# Altium project GUN.PrjPcb (part 2 of 2)

## Sheet 04-HallEffectSensor.SchDoc
size A
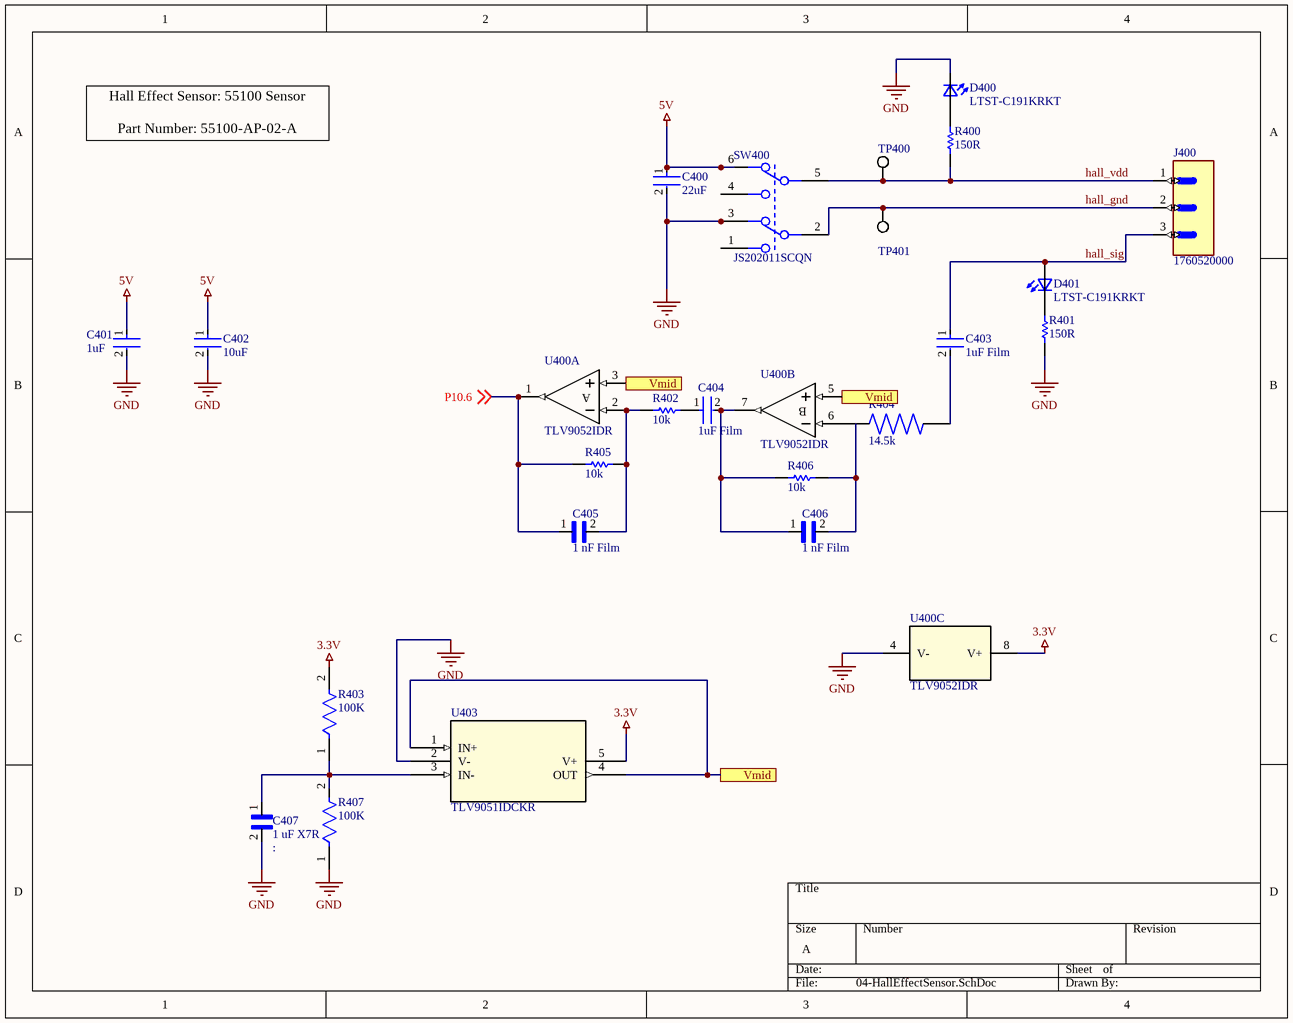
[diagram p3: 04-HallEffectSensor.SchDoc]

### Parts
C400  22uF  [FP-GRM21B-0_15-MFG]
C401  1uF  [FP-CC0805-0_85-MFG]
C402  value 10uF  [FP-C0805C-DG-MFG]  (hidden comment: C0805C106K8PACTU)
C403  1uF Film  [FP-R82DC4100DQ60J-MFG]
C404  1uF Film  [FP-R82DC4100DQ60J-MFG]
C405  1 nF Film  [CAPRR500W50L730T250H650]
C406  1 nF Film  [CAPRR500W50L730T250H650]
C407  1 uF X7R  [CAPC2012X140N]
D400  LTST-C191KRKT  [0603]
D401  LTST-C191KRKT  [0603]
J400  1760520000  [1760520000]
R400  150R  [RESC3216X70X50ML20T25]
R401  150R  [RESC2013X60X40NL20T25]
R402  10k  [RESC2013X60X35ML10T20]
R403  100K  [FP-RC0805-0_6-IPC_C]
R404  14.5k  [RESC2012X60N]
R405  10k  [RESC2013X60X35ML10T20]
R406  10k  [RESC2013X60X35ML10T20]
R407  100K  [FP-RC0805-0_6-IPC_C]
SW400  JS202011SCQN  [FP-JS202011SCQN-MFG]
TP400  5019  [KSTN-5019_V]  (value not drawn)
TP401  5019  [KSTN-5019_V]  (value not drawn)
U400  TLV9052IDR  [D0008A_N]  (parts A,B,C of 3)
U403  TLV9051IDCKR  [SOT_1IDCKR_TEX]

### Ports
Vmid

### Nets
3.3V: R403.2 U400.8(V+) U403.5(V+)
5V: C400.1 C401.1 C402.1 SW400.6
GND: C400.2 C401.2 C402.2 C407.2 D400.1(K2) R401.1 R407.1 SW400.3 U400.4(V-) U403.2(V-)
hall_gnd: J400.2 SW400.2 TP401.1
hall_sig: C403.1 D401.2(A2) J400.3
hall_vdd: J400.1 R400.1 SW400.5 TP400.1
P10.6: C405.1 R405.1 U400.1(OUT) ; off-sheet P10.6
NetC403_2: C403.2 R404.2
NetC404_1: C404.1 R402.2
NetC404_2: C404.2 C406.1 R406.1 U400.7(OUT)
NetC405_2: C405.2 R402.1 R405.2 U400.2(IN-)
NetC406_2: C406.2 R406.2
NetC407_1: C407.1 R403.1 R407.2 U403.3(IN-)
NetD400_2: D400.2(A2) R400.2
NetD401_1: D401.1(K2) R401.2
NetR404_1: R404.1 U400.6(IN-)
NetU400_3: U400.3(IN+) U400.5(IN+) U403.1(IN+) U403.4(OUT) ; port Vmid

Not connected (* = marked no-connect by the designer): SW400 1 4

### Notes on the sheet
- Hall Effect Sensor: 55100 Sensor
  Part Number: 55100-AP-02-A
- (in symbol TLV9052IDR, part A) A
- (in symbol TLV9052IDR, part B) B

### Library data of the parts
C400 = CMP-2007-03385-2: Manufacturer: Murata; Manufacturer Part Number: GRM21BR60J226ME39L; Material: Ceramic; Voltage: 6.3V; Dielectric: X5R; Tolerance: 20%; Max Operating Temperature: 85°C; Min Operating Temperature: -55°C; Case/Package: 0805; Thickness: 0.053inch; Packaging: Tape and Reel; Depth: 1.25mm; Termination: SMD/SMT; Voltage Rating (DC): 6.3V; Radiation Hardening: No; Mount: Surface Mount; Lead Free: Lead Free; Package Quantity: 1; REACH SVHC: No SVHC; Voltage Rating: 6.3V; Capacitance: 22uF; Length: 2mm; Case Code (Imperial): 0805; Case Code (Metric): 2012; Width: 0.049inch; Height: 1.25mm; Supplier 1: Digi-Key; Supplier Part Number 1: 490-1719-1-ND; RoHS: Yes; Category: Ceramic Capacitors; Stock 1: 2705091; Pricing 1: 1=0.37000, 10=0.25600, 50=0.17940, 100=0.15380, 500=0.11532, 1000=0.09739 (USD); Series: GRM; Construction: Flat; RoHS Compliant: Yes; Reach SVHC Compliant: Yes
C401 = CMP-03422-000182-1: CAP CER 1UF 10V X7R 0805; Manufacturer: Yageo; Manufacturer Part Number: CC0805KKX7R6BB105; Material: Ceramic; Tolerance: 0.1; Value: 1 uF; ComponentLink2URL: http://www.yageo.com/documents/recent/UPY-GPHC_Y5V_6.3V-to-50V_8.pdf; Automotive: No; Temperature Range Low: -30°C; Octopart: https://octopart.com/cc0805kkx7r6bb105-yageo-42522859; Temperature Characteristic: X7R; RoHS: TRUE; Voltage Rating: 10 V; Capacitance: 1 uF; Package: CC0805-0.85; Device Class L3: Ceramic Capacitors; Category: Cap; Mouser Description: Multilayer Ceramic Capacitors MLCC - SMD/SMT 1.0uF 10V X7R 10%; Temperature Range High: +85°C; Ipc Land Pattern Name: CAPC200125X85; ComponentLink2Description: Datasheet; Temperature: -30°C to +85°C; Height: 0.95mm; Lead Free: Yes; Device Class L1: Passive Components; Device Class L2: Capacitors; Footprint Url: http://www.yageo.com/exep/pages/download/literatures/UPY-C_GEN_24.pdf; Digikey Description: CAP CER 1UF 10V X7R 0805
C402 = CMP-2007-03243-2: CAP CER 10UF 10V X5R 0805; Manufacturer: Kemet; 3DS Part Number: 220-00001; Tolerance: 10%; Temperature Coefficient: 15%; Material: Ceramic; Device Class L2: Capacitors; Device Class L1: Passive Components; ComponentLink2URL: https://content.kemet.com/datasheets/KEM_C1006_X5R_SMD.pdf; Height: 1.4mm; Lead Free: Yes; Manufacturer Part Number: C0805C106K8PACTU; Digikey Description: CAP CER 10UF 10V X5R 0805; Octopart: https://octopart.com/c0805c106k8pactu-kemet-98697; Capacitance: 10uF; Temperature Range Low: -55°C; Temperature: -55°C to +85°C; Automotive: No; Mouser Description: CAP CER 10UF 10V X5R 0805; Ipc Land Pattern Name: CAPC200125X125; Temperature Range High: +85°C; Voltage: 10V; RoHS: TRUE; Device Class L3: Ceramic Capacitors; ComponentLink2Description: Datasheet; Voltage Rating: 10V; Package: C0805C-DG; Temperature Characteristic: X5R; Category: Cap; Supplier 1: Digi-Key; Supplier Part Number 1: 399-C0805C106K8PAC7800CT-ND; Manufacturer 1: KEMET; Manufacturer Part Number 1: C0805C106K8PACTU; Stock 1: 8631846; Pricing 1: 1=0.14000, 10=0.10300, 50=0.05840, 100=0.04830, 500=0.03388, 1000=0.02805 (USD); Mount: Surface Mount; Case/Package: 0805; Number of Pins: 2; Case Code (Imperial): 0805; Case Code (Metric): 2012; Dielectric Material: Ceramic; Contact Plating: Tin,Matte; Min Operating Temperature: -55°C; Max Operating Temperature: 85°C; Packaging: Tape and Reel; Dielectric: X5R; Package Quantity: 1; Voltage Rating (DC): 10V; Series: C; Termination: SMD/SMT; Construction: Flat; Dissipation Factor: 10%; Length: 2mm; Width: 1.2mm; Depth: 1.25mm; Thickness: 0.055inch; Radiation Hardening: No; REACH SVHC: No SVHC; RoHS Compliant: Yes
C403 C404 = CMP-03022-000017-1: CAP FILM 1UF 5% 63VDC RADIAL; Voltage Rating (DC): 63V; Lead Diameter: 0.5mm; Insulation Resistance: 30R; Dielectric: PET; Voltage Rating (AC): 40V; Dissipation Factor: 80%; Life (Hours): 2000Hour; Type: General Purpose; Mount: Through Hole; Case/Package: Radial; Package Quantity: 1700; Construction: RADIAL; Capacitance: 1uF; Lead Pitch: 5mm; Depth: 5mm; Series: R82; Packaging: Tape and Reel; RoHS Compliant: Yes; Voltage Rating: 63V; Height - Seated (Max): 0.398inch; Voltage: 63V; Radiation Hardening: No; Width: 5mm; REACH SVHC: No SVHC; Min Operating Temperature: -55°C; Tolerance: 5%; Dielectric Material: PET; Contact Plating: Tin; Termination: Radial; Length: 7.2mm; Max Operating Temperature: 105°C
C405 C406 = B32529C0102K289: 1000 pF Film Capacitor 40V 63V Polyester, Polyethylene Terephthalate (PET), Metallized - Stacked Radial; MF: TDK; Check_prices: https://www.snapeda.com/parts/B32529C0102K289/TDK/view-part/?ref=eda; Digi-Key_Part_Number: 495-2456-1-ND; Purchase-URL: https://pricing.snapeda.com/search/part/B32529C0102K289/?ref=eda; Value: *; SnapEDA_Link: https://www.snapeda.com/parts/B32529C0102K289/TDK/view-part/?ref=snap; Package: None; MP: B32529C0102K289; Supplier 1: Digi-Key; Supplier Part Number 1: 495-2456-1-ND
C407 = CL21B105KAFNNNE: 1ÂµF Â±10% 25V Ceramic Capacitor X7R 0805 (2012 Metric); MF: Samsung Electro-Mechanics; SnapEDA_Link: https://www.snapeda.com/parts/CL21B105KAFNNNE/Samsung%20Electro-Mechanics/view-part/544120/?ref=snap; Arrow_Electronics-Purchase-URL: https://snapeda.com/shop?store=Arrow+Electronics&id=544120; Arrow_Europe-Purchase-URL: https://snapeda.com/shop?store=Arrow+Europe&id=544120; MP: CL21B105KAFNNNE; Package: 0805 Samsung; DigiKey-Purchase-URL: https://snapeda.com/shop?store=DigiKey&id=544120; Digi-Key_Part_Number: 1276-1066-1-ND; Value: *; Supplier 1: Digi-Key; Supplier Part Number 1: 1276-1066-1-ND
D400 D401 = LTST-C191KRKT: http://octopart.com/ltst-c190krkt-lite-on-549893; Package: None; MP: LTST-C191KRKT; Value: *; Availability: Unavailable; Price: None; Supplier 1: Digi-Key; Supplier Part Number 1: 160-1447-1-ND
J400 = 1760520000: 3 Position Wire to Board Terminal Block Horizontal with Board 0.200 _5.08mm_ Through Hole; MF: Weidmuller; MP: 1760520000; SnapEDA_Link: https://www.snapeda.com/parts/1760520000/Weidmuller/view-part/423520/?ref=snap; Availability: Unavailable; Package: None; Value: *; Price: None; Supplier 1: Digi-Key; Supplier Part Number 1: 281-1883-ND
R400 = CMP-2003-04422-1: Manufacturer: Panasonic; Part Number: ERA8AEB151V
R401 = CMP-2001-00596-1: Manufacturer: Panasonic; Part Number: ERA6AEB151V
R402 R405 R406 = CMP-2000-05025-1: Chip Resistor, 10 KOhm, +/- 5%, 0.125 W, -55 to 155 degC, 0805 (2012 Metric), RoHS, Tape and Reel; Manufacturer: Yageo; Resistor Element Type: ThickFilm; Voltage Rating: 150V; Product Range: RCSeries; SVHC: ToBeAdvised; Resistor Case Style: 0805[2012Metric]; Temperature Coefficient: ±100ppm/degC; Power Rating: 250mW; Resistance: 10kohm; Automotive Qualification Standard: -; Datasheet Version: REV. 2, 09/2004; Packaging: CutTape; Resistance Tolerance: ±5%; MSL: MSL1-Unlimited; Manufacturer URL: http://www.yageo.com/; Datasheet URL: http://www.yageo.ru/pdf/RC0805.pdf; Package Description: 2-Pin Surface Mounted Device, Body 2 x 1.25 mm; Package Reference: 805
R403 R407 = CMP-2100-03668-5: RES 100K OHM 1% 1/8W 0805; Power Rating: 125mW; Temperature Coefficient: 100ppm/°C; Voltage Rating (DC): 150V; Resistance: 100kR; Package Quantity: 1; Case/Package: 0805; Lead Pitch: 0.4mm; Case Code (Imperial): 0805; Construction: Rectangular; Number of Terminations: 2; RoHS Compliant: Yes; Max Power Dissipation: 125mW; Tolerance: 1%; Max Operating Temperature: 155°C; Resistance Tolerance: 1%; Lead Free: Lead Free; Packaging: Tape and Reel; Resistor Type: Thick Film; Min Operating Temperature: -55°C; Case Code (Metric): 2012; Series: RC; Technology: THICK FILM; Voltage Rating: 150V; Termination: SMD/SMT; Width: 0.049inch; Number of Pins: 2; Features: Moisture Resistant; Military Standard: Not; Length: 0.079inch; Depth: 1.25mm; Size Code: 0805; Height: 0.024inch; Supplier: Digi-Key; Supplier Part Number: 311-100KCRCT-ND
R404 = RT0805DRE0714K5L: Package: None; Price: None; Value: *; MP: RT0805DRE0714K5L; Availability: Unavailable; Supplier 1: Digi-Key; Supplier Part Number 1: 311-2788-1-ND
SW400 = CMP-2000-05087-3: SWITCH SLIDE DPDT 300MA 6V; Switch Function: On-On; Actuator Type: Standard; Switch Travel: 2mm; Actuator Color: Black; Contact Resistance: 70mR; Electrical Life: 5000Cycles; Actuator Material: Nylon; REACH SVHC: No SVHC; Series: JS; Min Operating Temperature: -20°C; Depth: 7.5mm; Housing Material: Nylon; Voltage Rating (DC): 6V; Max Operating Temperature: 85°C; Contact Current Rating: 300mA; Package Quantity: 1; Contact Plating: Silver; Contact Material: Copper Alloy; Throw Configuration: DPDT; Current Rating: 300mA; Orientation: Vertical; Max Current Rating: 300mA; Max Voltage Rating (DC): 6V; Flammability Rating: UL94 V-2; Length: 9mm; Packaging: Tape and Reel; Mount: Surface Mount; Actuator Length: 2mm; Lead Free: Lead Free; Termination: Gull Wing; Radiation Hardening: No
TP400 TP401 = CMP-1672-00008-1: Test Point, 1 Position SMD, RoHS, Tape and Reel; Manufacturer 1: Keystone Electronics; ComponentLink1Description: Manufacturer URL; Package Quantity: 1000; DatasheetVersion: 03/2014; Packaging: Tape and Reel; ComponentLink2URL: http://www.keyelco.com/product-pdf.cfm?p=1357; ComponentLink1URL: http://www.keyelco.com/; Mount: Surface Mount; Contact Plating: Silver; PackageDescription: 1-Pin Surface Mount Device, Body 3.81 x 2.03 mm; Pins: 1; RoHSCompliant: True; Mounting Technology: Surface Mount; ComponentLink2Description: Datasheet; PackageReference: 5019; Supplier 1: Digi-Key; Supplier Part Number 1: 36-5019CT-ND; Manufacturer Part Number 1: 5019; RoHS: Yes; Category: Connectors; Stock 1: 1316816; Pricing 1: 1=0.34000, 25=0.27360, 100=0.22340, 250=0.20064, 500=0.19152 (USD); Number of Pins: 1; Material: Bronze; Contact Material: Bronze; Series: 5019; Termination: SMD/SMT; Height: 0.09inch; RoHS Compliant: Yes; REACH SVHC: No SVHC; Lead Free: Lead Free; ComponentLink3URL: https://datasheet.ciiva.com/16318/m60-2p61-16318395.pdf?src-supplier=Future+Electronics; ComponentLink3Description: https://datasheet.ciiva.com/16318/m60-2p61-16318395.pdf?src-supplier=Future+Electronics; ComponentLink4URL: https://datasheet.ciiva.com/16885/70182998-16885945.pdf?src-supplier=Allied+Electronics; ComponentLink4Description: https://datasheet.ciiva.com/16885/70182998-16885945.pdf?src-supplier=Allied+Electronics; ComponentLink5URL: https://datasheet.ciiva.com/14848/m60-2p61-14848437.pdf?src-supplier=Digi-Key; ComponentLink5Description: https://datasheet.ciiva.com/14848/m60-2p61-14848437.pdf?src-supplier=Digi-Key; ComponentLink6URL: https://datasheet.ciiva.com/14848/m60-2p61-14848438.pdf?src-supplier=Digi-Key; ComponentLink6Description: https://datasheet.ciiva.com/14848/m60-2p61-14848438.pdf?src-supplier=Digi-Key; ComponentLink7URL: https://datasheet.ciiva.com/14848/m60-2p61-14848439.pdf?src-supplier=Digi-Key; ComponentLink7Description: https://datasheet.ciiva.com/14848/m60-2p61-14848439.pdf?src-supplier=Digi-Key
U400 = TLV9052IDR: 5MHz 15V/us High Slew-Rate RRIO Operational Amplifier 8-Pin SOIC T/R; Mfr_Name: Texas Instruments; Type: DEV; RefDes: RefDes; Copyright: Copyright (C) 2023 Ultra Librarian. All rights reserved.; Manufacturer_Part_Number: TLV9052IDR; Supplier: Digi-Key; Supplier Part Number: 296-53049-1-ND; Manufacturer: Texas Instruments; Manufacturer Part Number: TLV9052IDR; RoHS: Yes; Category: Amplifiers - Op Amps, Buffer, Instrumentation; Stock: 44741; Pricing: 1=0.93000, 10=0.82200, 25=0.77240, 100=0.63020, 250=0.58540, 500=0.49820, 1000=0.39856 (USD); RoHS Compliant: Yes; ComponentLink1URL: http://www.ti.com/general/docs/suppproductinfo.tsp?distId=10&amp;gotoUrl=http%3A%2F%2Fwww.ti.com%2Flit%2Fgpn%2Ftlv9052&src-supplier=Digi-Key; ComponentLink1Description: http://www.ti.com/general/docs/suppproductinfo.tsp?distId=10&amp;gotoUrl=http%3A%2F%2Fwww.ti.com%2Flit%2Fgpn%2Ftlv9052&src-supplier=Digi-Key; Supplier 1: Digi-Key; Supplier Part Number 1: 296-53049-1-ND
U403 = TLV9051IDCKR: Single 5-MHz, 15-V/µs high slew-rate, RRIO op amp 5-SC70 -40 to 125; Mfr_Name: Texas Instruments; Copyright: Copyright (C) 2023 Ultra Librarian. All rights reserved.; Manufacturer_Part_Number: TLV9051IDCKR; RefDes: RefDes; Type: DEV; Supplier: Digi-Key; Supplier Part Number: 296-TLV9051IDCKRCT-ND; Manufacturer: Texas Instruments; Manufacturer Part Number: TLV9051IDCKR; RoHS: Yes; Category: Amplifiers - Op Amps, Buffer, Instrumentation; Stock: 2075; Pricing: 1=0.62000, 10=0.54200, 25=0.50920, 100=0.41570, 250=0.38612, 500=0.32860, 1000=0.26288 (USD); Supplier 1: Digi-Key; Supplier Part Number 1: 296-TLV9051IDCKRCT-ND

## Sheet 05-StepperMotor.SchDoc
size A
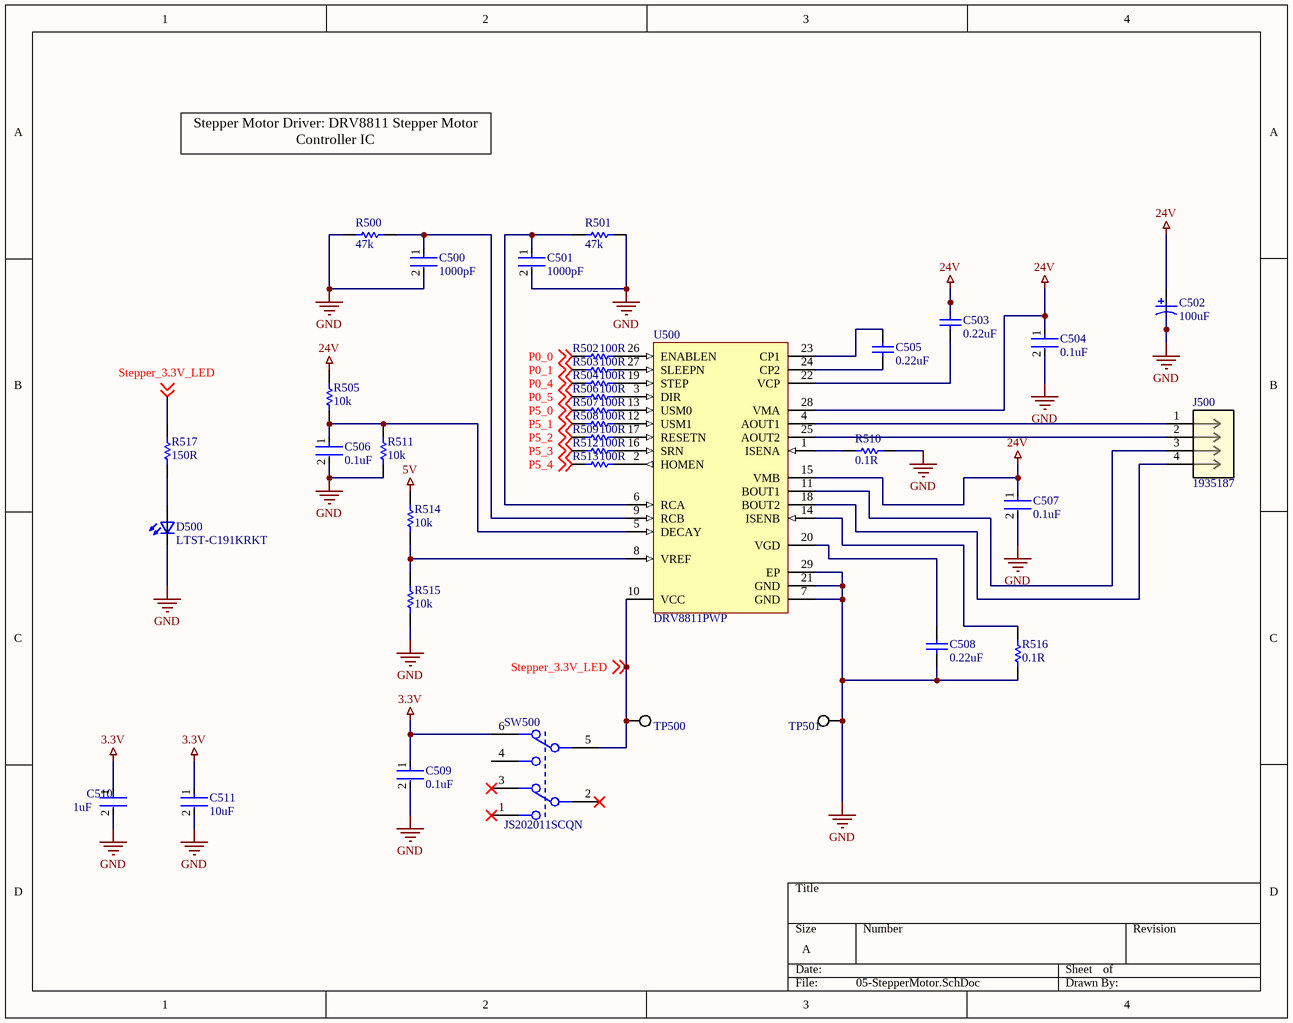
[diagram p4: 05-StepperMotor.SchDoc]

### Parts
C500  1000pF  [FP-0805-L_2_01_0_2-W_1_25-IPC_C]
C501  1000pF  [FP-0805-L_2_01_0_2-W_1_25-IPC_C]
C502  100uF  [PNSC-EEEFK1C101P_L]
C503  0.22uF  [CAPC2013X94X50ML20T25]
C504  0.1uF  [FP-CL21-IPC_C]
C505  0.22uF  [CAPC2013X94X50ML20T25]
C506  0.1uF  [FP-CL21-IPC_C]
C507  0.1uF  [FP-CL21-IPC_C]
C508  0.22uF  [CAPC2013X94X50ML20T25]
C509  0.1uF  [FP-CL21-IPC_C]
C510  1uF  [FP-CC0805-0_85-MFG]
C511  value 10uF  [FP-C0805C-DG-MFG]  (hidden comment: C0805C106K8PACTU)
D500  LTST-C191KRKT  [0603]
J500  1935187  [1935187]
R500  47k  [RESC2013X70X40ML20T20]
R501  47k  [RESC2013X70X40ML20T20]
R502  100R  [RESC2013X60X40ML20T25]
R503  100R  [RESC2013X60X40ML20T25]
R504  100R  [RESC2013X60X40ML20T25]
R505  10k  [RESC2013X60X35ML10T20]
R506  100R  [RESC2013X60X40ML20T25]
R507  100R  [RESC2013X60X40ML20T25]
R508  100R  [RESC2013X60X40ML20T25]
R509  100R  [RESC2013X60X40ML20T25]
R510  0.1R  [RESC2013X50X40ML20T20]
R511  10k  [RESC2013X60X35ML10T20]
R512  100R  [RESC2013X60X40ML20T25]
R513  100R  [RESC2013X60X40ML20T25]
R514  10k  [RESC2013X60X35ML10T20]
R515  10k  [RESC2013X60X35ML10T20]
R516  0.1R  [RESC2013X50X40ML20T20]
R517  150R  [RESC3216X70X50ML20T25]
SW500  JS202011SCQN  [FP-JS202011SCQN-MFG]
TP500  5019  [KSTN-5019_V]  (value not drawn)
TP501  5019  [KSTN-5019_V]  (value not drawn)
U500  DRV8811PWP  [StepperMotor]

### Nets
3.3V: C509.1 C510.1 C511.1 SW500.6
5V: R514.2
24V: C502.1 C503.2 C504.1 C507.1 R505.2 U500.15(VMB) U500.28(VMA)
GND: C500.2 C501.2 C502.2 C504.2 C506.2 C507.2 C508.1 C509.2 C510.2 C511.2 D500.1(K2) R500.1 R501.2 R510.2 R511.1 R515.1 R516.1 TP501.1 U500.7(GND) U500.21(GND) U500.29(EP)
P0_0: R502.1 ; off-sheet P0_0
P0_1: R503.1 ; off-sheet P0_1
P0_4: R504.1 ; off-sheet P0_4
P0_5: R506.1 ; off-sheet P0_5
P5_0: R507.1 ; off-sheet P5_0
P5_1: R508.1 ; off-sheet P5_1
P5_2: R509.1 ; off-sheet P5_2
P5_3: R512.1 ; off-sheet P5_3
P5_4: R513.1 ; off-sheet P5_4
Stepper_3.3V_LED: R517.2 SW500.5 TP500.1 U500.10(VCC) ; off-sheet Stepper_3.3V_LED
NetC500_1: C500.1 R500.2 U500.9(RCB)
NetC501_1: C501.1 R501.1 U500.6(RCA)
NetC503_1: C503.1 U500.22(VCP)
NetC505_1: C505.1 U500.24(CP2)
NetC505_2: C505.2 U500.23(CP1)
NetC506_1: C506.1 R505.1 R511.2 U500.5(DECAY)
NetC508_2: C508.2 U500.20(VGD)
NetD500_2: D500.2(A2) R517.1
NetJ500_1: J500.1 U500.4(AOUT1)
NetJ500_2: J500.2 U500.25(AOUT2)
NetJ500_3: J500.3 U500.11(BOUT1)
NetJ500_4: J500.4 U500.18(BOUT2)
NetR502_2: R502.2 U500.26(ENABLEN)
NetR503_2: R503.2 U500.27(SLEEPN)
NetR504_2: R504.2 U500.19(STEP)
NetR506_2: R506.2 U500.3(DIR)
NetR507_2: R507.2 U500.13(USM0)
NetR508_2: R508.2 U500.12(USM1)
NetR509_2: R509.2 U500.17(RESETN)
NetR510_1: R510.1 U500.1(ISENA)
NetR512_2: R512.2 U500.16(SRN)
NetR513_2: R513.2 U500.2(HOMEN)
NetR514_1: R514.1 R515.2 U500.8(VREF)
NetR516_2: R516.2 U500.14(ISENB)

Not connected (* = marked no-connect by the designer): SW500 1* 2* 3* 4

### Notes on the sheet
- Stepper Motor Driver: DRV8811 Stepper Motor Controller IC

### Library data of the parts
C500 C501 = CMP-2007-04270-2: General Purpose Ceramic Capacitor, 0805, 1nF, 5%, C0G, 30ppm/°C, 50V; Insulation Resistance: 100GR; Capacitance: 1nF; Voltage Rating (DC): 50V; Packaging: Tape and Reel; Min Operating Temperature: -55°C; Series: -; Construction: Flat; Tolerance: 5%; RoHS Compliant: Yes; Package Quantity: 1; Case Code (Metric): 2012; Lead Free: Lead Free; Thickness: 0.037inch; REACH SVHC: No SVHC; Temperature Coefficient: 30ppm/°C; Case/Package: 0805; Case Code: 0805; Radiation Hardening: No; Size: 0.94mm; Height: 0.94mm; Width: 0.049inch; Number of Pins: 2; Depth: 1.25mm; Dielectric: C0G; Contact Plating: Tin; Length: 2.01mm; Voltage: 50V; Voltage Rating: 50V; Max Operating Temperature: 125°C; Mount: Surface Mount; Case Code (Imperial): 0805; Termination: SMD/SMT
C502 = CMP-2000-06203-1: Aluminum Electrolytic Capacitor, 100 uF, 20%, 16 V, -55 to 105 degC, 2-Pin SMD, RoHS, Tape and Reel; Manufacturer: Panasonic; Lifetime@Temperature: 2000Hrs@105°C; Impedance: 0.36O; Ripple Current: 240mA; Rated Voltage: 16V; Type: Can; Capacitance: 100µF; Datasheet URL: http://datasheet.octopart.com/EEEFK1C101P-Panasonic-datasheet-13266987.pdf; Package Description: 2-Pin Surface Mount Device, Body 6.6 x 6.6 mm; Manufacturer URL: http://www.panasonic.com/; Case Size/Dimension: Ø6.3x5.8mm; Series: FK; Datasheet Version: 11/2012; Mounting Technology: SurfaceMount; Package Reference: EEEFK1C101P; Operating Temp-Max: 105°C; Operating Temp Range: -55to+105°C
C503 C505 C508 = CMP-2007-04189-1: Part Number: 08051C224KAT2A; Manufacturer: AVX Interconnect / Elco
C504 C506 C507 C509 = CMP-2000-05017-2: CL21 Series 0805 100nF 50V ±10% Tolerance X7R Multilayer Ceramic Chip Capacitor; Depth: 1.25mm; Height: 0.85mm; Width: 0.049inch; Tolerance: 10%; Case Code (Metric): 2012; Case Code (Imperial): 0805; Material: Ceramic; Thickness: 0.037inch; Min Operating Temperature: -55°C; Contact Plating: Tin; Length: 2mm; Mount: Surface Mount; Voltage Rating (DC): 50V; Lead Free: Lead Free; Dielectric: X7R; Radiation Hardening: No; Capacitance: 100nF; Voltage Rating: 50V; Case/Package: 0805; Packaging: Tape and Reel; Max Operating Temperature: 125°C; Voltage: 50V
C510 = CMP-03422-000182-1: as C401 on sheet 04-HallEffectSensor; Value: 1 uF; ComponentLink2URL: http://www.yageo.com/documents/recent/UPY-GPHC_Y5V_6.3V-to-50V_8.pdf; Automotive: No; Temperature Range Low: -30°C; Octopart: https://octopart.com/cc0805kkx7r6bb105-yageo-42522859; Temperature Characteristic: X7R; RoHS: TRUE; Voltage Rating: 10 V; Capacitance: 1 uF; Package: CC0805-0.85; Device Class L3: Ceramic Capacitors; Category: Cap; Mouser Description: Multilayer Ceramic Capacitors MLCC - SMD/SMT 1.0uF 10V X7R 10%; Temperature Range High: +85°C; Ipc Land Pattern Name: CAPC200125X85; ComponentLink2Description: Datasheet; Temperature: -30°C to +85°C; Height: 0.95mm; Lead Free: Yes; Device Class L1: Passive Components; Device Class L2: Capacitors; Footprint Url: http://www.yageo.com/exep/pages/download/literatures/UPY-C_GEN_24.pdf; Digikey Description: CAP CER 1UF 10V X7R 0805
C511 = CMP-2007-03243-2: as C402 on sheet 04-HallEffectSensor; Device Class L2: Capacitors; Device Class L1: Passive Components; ComponentLink2URL: https://content.kemet.com/datasheets/KEM_C1006_X5R_SMD.pdf; Height: 1.4mm; Lead Free: Yes; Manufacturer Part Number: C0805C106K8PACTU; Digikey Description: CAP CER 10UF 10V X5R 0805; Octopart: https://octopart.com/c0805c106k8pactu-kemet-98697; Capacitance: 10uF; Temperature Range Low: -55°C; Temperature: -55°C to +85°C; Automotive: No; Mouser Description: CAP CER 10UF 10V X5R 0805; Ipc Land Pattern Name: CAPC200125X125; Temperature Range High: +85°C; Voltage: 10V; RoHS: TRUE; Device Class L3: Ceramic Capacitors; ComponentLink2Description: Datasheet; Voltage Rating: 10V; Package: C0805C-DG; Temperature Characteristic: X5R; Category: Cap; Supplier 1: Digi-Key; Supplier Part Number 1: 399-C0805C106K8PAC7800CT-ND; Manufacturer 1: KEMET; Manufacturer Part Number 1: C0805C106K8PACTU; Stock 1: 8631846; Pricing 1: 1=0.14000, 10=0.10300, 50=0.05840, 100=0.04830, 500=0.03388, 1000=0.02805 (USD); Mount: Surface Mount; Case/Package: 0805; Number of Pins: 2; Case Code (Imperial): 0805; Case Code (Metric): 2012; Dielectric Material: Ceramic; Contact Plating: Tin,Matte; Min Operating Temperature: -55°C; Max Operating Temperature: 85°C; Packaging: Tape and Reel; Dielectric: X5R; Package Quantity: 1; Voltage Rating (DC): 10V; Series: C; Termination: SMD/SMT; Construction: Flat; Dissipation Factor: 10%; Length: 2mm; Width: 1.2mm; Depth: 1.25mm; Thickness: 0.055inch; Radiation Hardening: No; REACH SVHC: No SVHC; RoHS Compliant: Yes
D500 = LTST-C191KRKT: as D400 on sheet 04-HallEffectSensor; Package: None; MP: LTST-C191KRKT; Value: *; Availability: Unavailable; Price: None; Supplier 1: Digi-Key; Supplier Part Number 1: 160-1447-1-ND
J500 = 1935187: No Description Available; Mfr_Name: Phoenix Contact; RefDes: RefDes; Type: Type; Supplier 1: Digi-Key; Supplier Part Number 1: 277-1579-ND
R500 R501 = CMP-2001-00421-1: Manufacturer: Panasonic; Part Number: ERJ-6GEYJ473V
R502-R504 R506-R509 R512 R513 = CMP-2001-00580-1: Manufacturer: Panasonic; Part Number: ERA6AEB101V
R505 R511 R514 R515 = CMP-2000-05025-1: as R402 on sheet 04-HallEffectSensor; Automotive Qualification Standard: -; Datasheet Version: REV. 2, 09/2004; Packaging: CutTape; Resistance Tolerance: ±5%; MSL: MSL1-Unlimited; Manufacturer URL: http://www.yageo.com/; Datasheet URL: http://www.yageo.ru/pdf/RC0805.pdf; Package Description: 2-Pin Surface Mounted Device, Body 2 x 1.25 mm; Package Reference: 805
R510 R516 = CMP-2001-03150-1: Manufacturer: Susumu; Part Number: RL1220S-R10-F
R517 = CMP-2003-04422-1: as R400 on sheet 04-HallEffectSensor
SW500 = CMP-2000-05087-3: as SW400 on sheet 04-HallEffectSensor; REACH SVHC: No SVHC; Series: JS; Min Operating Temperature: -20°C; Depth: 7.5mm; Housing Material: Nylon; Voltage Rating (DC): 6V; Max Operating Temperature: 85°C; Contact Current Rating: 300mA; Package Quantity: 1; Contact Plating: Silver; Contact Material: Copper Alloy; Throw Configuration: DPDT; Current Rating: 300mA; Orientation: Vertical; Max Current Rating: 300mA; Max Voltage Rating (DC): 6V; Flammability Rating: UL94 V-2; Length: 9mm; Packaging: Tape and Reel; Mount: Surface Mount; Actuator Length: 2mm; Lead Free: Lead Free; Termination: Gull Wing; Radiation Hardening: No
TP500 TP501 = CMP-1672-00008-1: as TP400 on sheet 04-HallEffectSensor; ComponentLink1Description: Manufacturer URL; Package Quantity: 1000; DatasheetVersion: 03/2014; Packaging: Tape and Reel; ComponentLink2URL: http://www.keyelco.com/product-pdf.cfm?p=1357; ComponentLink1URL: http://www.keyelco.com/; Mount: Surface Mount; Contact Plating: Silver; PackageDescription: 1-Pin Surface Mount Device, Body 3.81 x 2.03 mm; Pins: 1; RoHSCompliant: True; Mounting Technology: Surface Mount; ComponentLink2Description: Datasheet; PackageReference: 5019; Supplier 1: Digi-Key; Supplier Part Number 1: 36-5019CT-ND; Manufacturer Part Number 1: 5019; RoHS: Yes; Category: Connectors; Stock 1: 1316816; Pricing 1: 1=0.34000, 25=0.27360, 100=0.22340, 250=0.20064, 500=0.19152 (USD); Number of Pins: 1; Material: Bronze; Contact Material: Bronze; Series: 5019; Termination: SMD/SMT; Height: 0.09inch; RoHS Compliant: Yes; REACH SVHC: No SVHC; Lead Free: Lead Free; ComponentLink3URL: https://datasheet.ciiva.com/16318/m60-2p61-16318395.pdf?src-supplier=Future+Electronics; ComponentLink3Description: https://datasheet.ciiva.com/16318/m60-2p61-16318395.pdf?src-supplier=Future+Electronics; ComponentLink4URL: https://datasheet.ciiva.com/16885/70182998-16885945.pdf?src-supplier=Allied+Electronics; ComponentLink4Description: https://datasheet.ciiva.com/16885/70182998-16885945.pdf?src-supplier=Allied+Electronics; ComponentLink5URL: https://datasheet.ciiva.com/14848/m60-2p61-14848437.pdf?src-supplier=Digi-Key; ComponentLink5Description: https://datasheet.ciiva.com/14848/m60-2p61-14848437.pdf?src-supplier=Digi-Key; ComponentLink6URL: https://datasheet.ciiva.com/14848/m60-2p61-14848438.pdf?src-supplier=Digi-Key; ComponentLink6Description: https://datasheet.ciiva.com/14848/m60-2p61-14848438.pdf?src-supplier=Digi-Key; ComponentLink7URL: https://datasheet.ciiva.com/14848/m60-2p61-14848439.pdf?src-supplier=Digi-Key; ComponentLink7Description: https://datasheet.ciiva.com/14848/m60-2p61-14848439.pdf?src-supplier=Digi-Key
U500 = StepperMotor: 1.9 A Bipolar Stepper Motor Driver with On-Chip 1 / 8 Microstepping Indexer (Step / Dir Ctrl), -40 to 85 degC, 28-pin HTSSOP (PWP), Green (RoHS & no Sb/Br); Thermal Shutdown: TRUE; Peak Output Current(A): 1.9; PackageVersion: 4073225-6/I, 05/2011; ComponentLink2URL: http://www.ti.com/general/docs/lit/getliterature.tsp?genericPartNumber=DRV8811&fileType=pdf; Eco-Plan: Green (RoHS & no Sb/Br); ComponentLink3URL: http://www.ti.com/litv/pdf/mpds373; PackageDescription: 28-Pin Plastic Small Outline, Body 9.70 x 4.40 mm, Pitch 0.65 mm; DatasheetVersion: SLVS865G; Code_JEDEC: MO-153; ComponentLink1URL: http://www.ti.com/; ComponentLink1Description: Manufacturer URL; ComponentLink2Description: Datasheet; Package Reference: PWP0028C; PartNumber: DRV8811PWP; Mounting Technology: Surface Mount; ComponentLink3Description: Package Specification

## Sheet 06-ServoMotor.SchDoc
size A
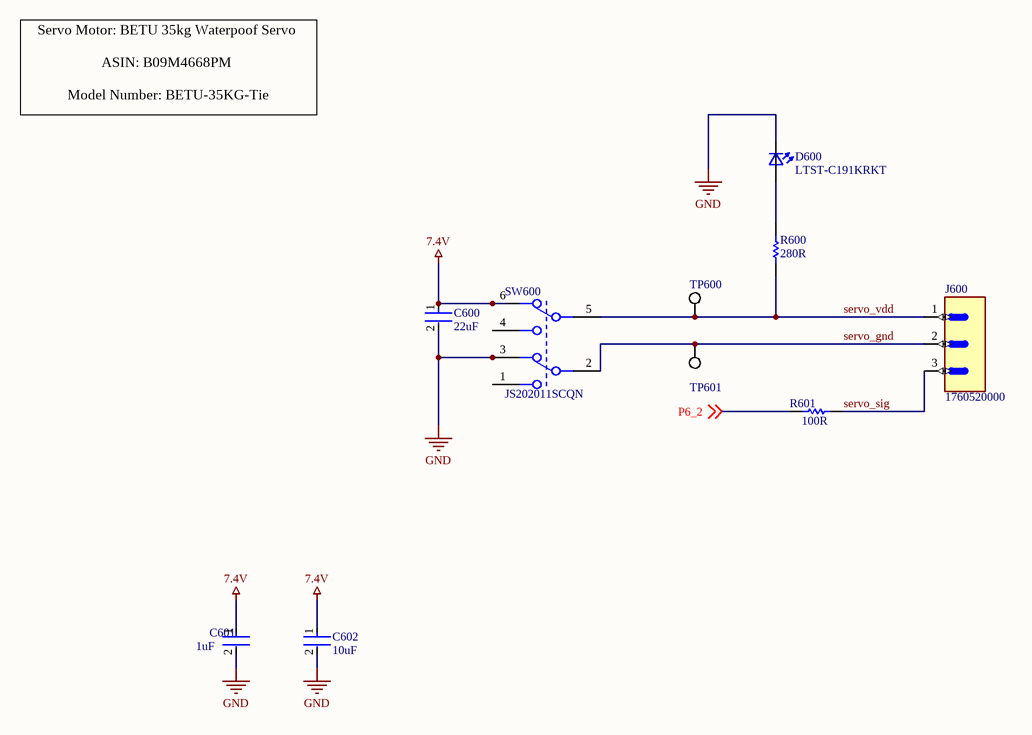
[diagram p5: 06-ServoMotor.SchDoc]

### Parts
C600  22uF  [FP-GRM21B-0_15-MFG]
C601  1uF  [FP-CC0805-0_85-MFG]
C602  value 10uF  [FP-C0805C-DG-MFG]  (hidden comment: C0805C106K8PACTU)
D600  LTST-C191KRKT  [0603]
J600  1760520000  [1760520000]
R600  280R  [RESC3225X70X50LL20T20]
R601  100R  [RESC2013X60X40ML20T25]
SW600  JS202011SCQN  [FP-JS202011SCQN-MFG]
TP600  5019  [KSTN-5019_V]  (value not drawn)
TP601  5019  [KSTN-5019_V]  (value not drawn)

### Nets
7.4V: C600.1 C601.1 C602.1 SW600.6
GND: C600.2 C601.2 C602.2 D600.1(K2) SW600.3
P6_2: R601.1 ; off-sheet P6_2
servo_gnd: J600.2 SW600.2 TP601.1
servo_sig: J600.3 R601.2
servo_vdd: J600.1 R600.1 SW600.5 TP600.1
NetD600_2: D600.2(A2) R600.2

Not connected (* = marked no-connect by the designer): SW600 1 4

### Notes on the sheet
- Servo Motor: BETU 35kg Waterpoof Servo
  ASIN: B09M4668PM
  Model Number: BETU-35KG-Tie

### Library data of the parts
C600 = CMP-2007-03385-2: as C400 on sheet 04-HallEffectSensor; Max Operating Temperature: 85°C; Min Operating Temperature: -55°C; Case/Package: 0805; Thickness: 0.053inch; Packaging: Tape and Reel; Depth: 1.25mm; Termination: SMD/SMT; Voltage Rating (DC): 6.3V; Radiation Hardening: No; Mount: Surface Mount; Lead Free: Lead Free; Package Quantity: 1; REACH SVHC: No SVHC; Voltage Rating: 6.3V; Capacitance: 22uF; Length: 2mm; Case Code (Imperial): 0805; Case Code (Metric): 2012; Width: 0.049inch; Height: 1.25mm; Supplier 1: Digi-Key; Supplier Part Number 1: 490-1719-1-ND; RoHS: Yes; Category: Ceramic Capacitors; Stock 1: 2705091; Pricing 1: 1=0.37000, 10=0.25600, 50=0.17940, 100=0.15380, 500=0.11532, 1000=0.09739 (USD); Series: GRM; Construction: Flat; RoHS Compliant: Yes; Reach SVHC Compliant: Yes
C601 = CMP-03422-000182-1: as C401 on sheet 04-HallEffectSensor; Value: 1 uF; ComponentLink2URL: http://www.yageo.com/documents/recent/UPY-GPHC_Y5V_6.3V-to-50V_8.pdf; Automotive: No; Temperature Range Low: -30°C; Octopart: https://octopart.com/cc0805kkx7r6bb105-yageo-42522859; Temperature Characteristic: X7R; RoHS: TRUE; Voltage Rating: 10 V; Capacitance: 1 uF; Package: CC0805-0.85; Device Class L3: Ceramic Capacitors; Category: Cap; Mouser Description: Multilayer Ceramic Capacitors MLCC - SMD/SMT 1.0uF 10V X7R 10%; Temperature Range High: +85°C; Ipc Land Pattern Name: CAPC200125X85; ComponentLink2Description: Datasheet; Temperature: -30°C to +85°C; Height: 0.95mm; Lead Free: Yes; Device Class L1: Passive Components; Device Class L2: Capacitors; Footprint Url: http://www.yageo.com/exep/pages/download/literatures/UPY-C_GEN_24.pdf; Digikey Description: CAP CER 1UF 10V X7R 0805
C602 = CMP-2007-03243-2: as C402 on sheet 04-HallEffectSensor; Device Class L2: Capacitors; Device Class L1: Passive Components; ComponentLink2URL: https://content.kemet.com/datasheets/KEM_C1006_X5R_SMD.pdf; Height: 1.4mm; Lead Free: Yes; Manufacturer Part Number: C0805C106K8PACTU; Digikey Description: CAP CER 10UF 10V X5R 0805; Octopart: https://octopart.com/c0805c106k8pactu-kemet-98697; Capacitance: 10uF; Temperature Range Low: -55°C; Temperature: -55°C to +85°C; Automotive: No; Mouser Description: CAP CER 10UF 10V X5R 0805; Ipc Land Pattern Name: CAPC200125X125; Temperature Range High: +85°C; Voltage: 10V; RoHS: TRUE; Device Class L3: Ceramic Capacitors; ComponentLink2Description: Datasheet; Voltage Rating: 10V; Package: C0805C-DG; Temperature Characteristic: X5R; Category: Cap; Supplier 1: Digi-Key; Supplier Part Number 1: 399-C0805C106K8PAC7800CT-ND; Manufacturer 1: KEMET; Manufacturer Part Number 1: C0805C106K8PACTU; Stock 1: 8631846; Pricing 1: 1=0.14000, 10=0.10300, 50=0.05840, 100=0.04830, 500=0.03388, 1000=0.02805 (USD); Mount: Surface Mount; Case/Package: 0805; Number of Pins: 2; Case Code (Imperial): 0805; Case Code (Metric): 2012; Dielectric Material: Ceramic; Contact Plating: Tin,Matte; Min Operating Temperature: -55°C; Max Operating Temperature: 85°C; Packaging: Tape and Reel; Dielectric: X5R; Package Quantity: 1; Voltage Rating (DC): 10V; Series: C; Termination: SMD/SMT; Construction: Flat; Dissipation Factor: 10%; Length: 2mm; Width: 1.2mm; Depth: 1.25mm; Thickness: 0.055inch; Radiation Hardening: No; REACH SVHC: No SVHC; RoHS Compliant: Yes
D600 = LTST-C191KRKT: as D400 on sheet 04-HallEffectSensor; Package: None; MP: LTST-C191KRKT; Value: *; Availability: Unavailable; Price: None; Supplier 1: Digi-Key; Supplier Part Number 1: 160-1447-1-ND
J600 = 1760520000: as J400 on sheet 04-HallEffectSensor; MP: 1760520000; SnapEDA_Link: https://www.snapeda.com/parts/1760520000/Weidmuller/view-part/423520/?ref=snap; Availability: Unavailable; Package: None; Value: *; Price: None; Supplier 1: Digi-Key; Supplier Part Number 1: 281-1883-ND
R600 = CMP-2005-03252-1: Part Number: ERJ-14NF2800U; Manufacturer: Panasonic
R601 = CMP-2001-00580-1: as R502 on sheet 05-StepperMotor
SW600 = CMP-2000-05087-3: as SW400 on sheet 04-HallEffectSensor; REACH SVHC: No SVHC; Series: JS; Min Operating Temperature: -20°C; Depth: 7.5mm; Housing Material: Nylon; Voltage Rating (DC): 6V; Max Operating Temperature: 85°C; Contact Current Rating: 300mA; Package Quantity: 1; Contact Plating: Silver; Contact Material: Copper Alloy; Throw Configuration: DPDT; Current Rating: 300mA; Orientation: Vertical; Max Current Rating: 300mA; Max Voltage Rating (DC): 6V; Flammability Rating: UL94 V-2; Length: 9mm; Packaging: Tape and Reel; Mount: Surface Mount; Actuator Length: 2mm; Lead Free: Lead Free; Termination: Gull Wing; Radiation Hardening: No
TP600 TP601 = CMP-1672-00008-1: as TP400 on sheet 04-HallEffectSensor; ComponentLink1Description: Manufacturer URL; Package Quantity: 1000; DatasheetVersion: 03/2014; Packaging: Tape and Reel; ComponentLink2URL: http://www.keyelco.com/product-pdf.cfm?p=1357; ComponentLink1URL: http://www.keyelco.com/; Mount: Surface Mount; Contact Plating: Silver; PackageDescription: 1-Pin Surface Mount Device, Body 3.81 x 2.03 mm; Pins: 1; RoHSCompliant: True; Mounting Technology: Surface Mount; ComponentLink2Description: Datasheet; PackageReference: 5019; Supplier 1: Digi-Key; Supplier Part Number 1: 36-5019CT-ND; Manufacturer Part Number 1: 5019; RoHS: Yes; Category: Connectors; Stock 1: 1316816; Pricing 1: 1=0.34000, 25=0.27360, 100=0.22340, 250=0.20064, 500=0.19152 (USD); Number of Pins: 1; Material: Bronze; Contact Material: Bronze; Series: 5019; Termination: SMD/SMT; Height: 0.09inch; RoHS Compliant: Yes; REACH SVHC: No SVHC; Lead Free: Lead Free; ComponentLink3URL: https://datasheet.ciiva.com/16318/m60-2p61-16318395.pdf?src-supplier=Future+Electronics; ComponentLink3Description: https://datasheet.ciiva.com/16318/m60-2p61-16318395.pdf?src-supplier=Future+Electronics; ComponentLink4URL: https://datasheet.ciiva.com/16885/70182998-16885945.pdf?src-supplier=Allied+Electronics; ComponentLink4Description: https://datasheet.ciiva.com/16885/70182998-16885945.pdf?src-supplier=Allied+Electronics; ComponentLink5URL: https://datasheet.ciiva.com/14848/m60-2p61-14848437.pdf?src-supplier=Digi-Key; ComponentLink5Description: https://datasheet.ciiva.com/14848/m60-2p61-14848437.pdf?src-supplier=Digi-Key; ComponentLink6URL: https://datasheet.ciiva.com/14848/m60-2p61-14848438.pdf?src-supplier=Digi-Key; ComponentLink6Description: https://datasheet.ciiva.com/14848/m60-2p61-14848438.pdf?src-supplier=Digi-Key; ComponentLink7URL: https://datasheet.ciiva.com/14848/m60-2p61-14848439.pdf?src-supplier=Digi-Key; ComponentLink7Description: https://datasheet.ciiva.com/14848/m60-2p61-14848439.pdf?src-supplier=Digi-Key

## Sheet 07-UARTBridge.SchDoc
size A
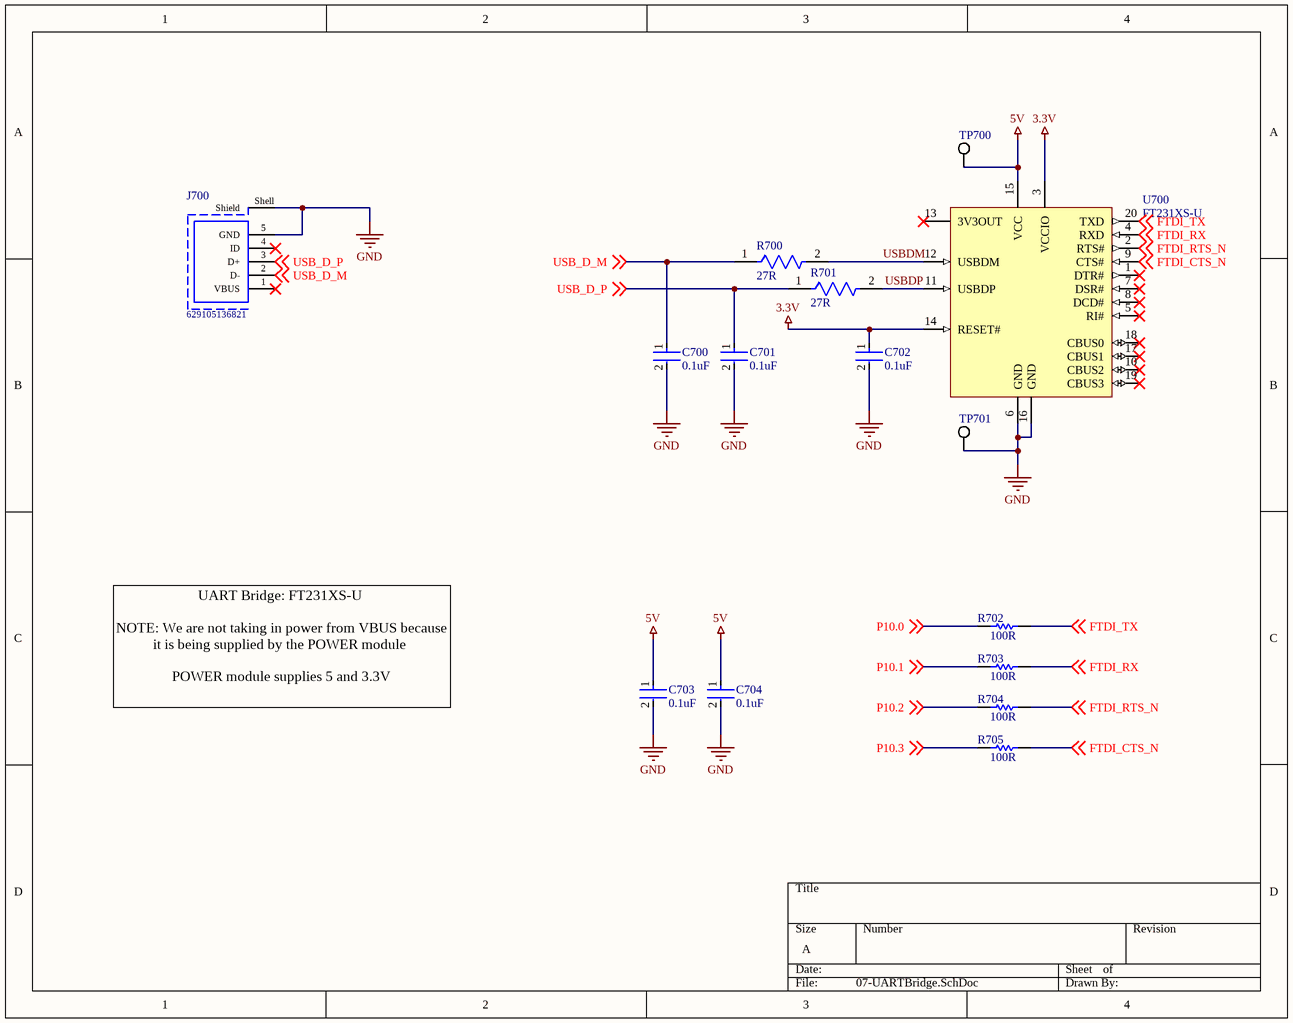
[diagram p6: 07-UARTBridge.SchDoc]

### Parts
C700  0.1uF  [FP-CL21-IPC_C]
C701  0.1uF  [FP-CL21-IPC_C]
C702  0.1uF  [FP-CL21-IPC_C]
C703  0.1uF  [FP-CL21-IPC_C]
C704  0.1uF  [FP-CL21-IPC_C]
J700  629105136821  [629105136821]
R700  27R  [FP-CRGCQ0805-IPC_C]
R701  27R  [FP-CRGCQ0805-IPC_C]
R702  100R  [RESC2013X60X40ML20T25]
R703  100R  [RESC2013X60X40ML20T25]
R704  100R  [RESC2013X60X40ML20T25]
R705  100R  [RESC2013X60X40ML20T25]
TP700  5019  [KSTN-5019_V]  (value not drawn)
TP701  5019  [KSTN-5019_V]  (value not drawn)
U700  FT231XS-U  [SSOP-20_L]

### Nets
3.3V: C702.1 U700.3(VCCIO) U700.14(RESET#)
5V: C703.1 C704.1 TP700.1 U700.15(VCC)
GND: C700.2 C701.2 C702.2 C703.2 C704.2 J700.5(GND) J700.Shell(Shield) TP701.1 U700.6(GND) U700.16(GND)
FTDI_CTS_N: R705.2 U700.9(CTS#) ; off-sheet FTDI_CTS_N
FTDI_RTS_N: R704.2 U700.2(RTS#) ; off-sheet FTDI_RTS_N
FTDI_RX: R703.2 U700.4(RXD) ; off-sheet FTDI_RX
FTDI_TX: R702.2 U700.20(TXD) ; off-sheet FTDI_TX
P10.0: R702.1 ; off-sheet P10.0
P10.1: R703.1 ; off-sheet P10.1
P10.2: R704.1 ; off-sheet P10.2
P10.3: R705.1 ; off-sheet P10.3
USB_D_M: C700.1 J700.2(D-) R700.1 ; off-sheet USB_D_M
USB_D_P: C701.1 J700.3(D+) R701.1 ; off-sheet USB_D_P
USBDM: R700.2 U700.12(USBDM)
USBDP: R701.2 U700.11(USBDP)

Not connected (* = marked no-connect by the designer): J700 1(VBUS)* 4(ID)*; U700 1(DTR#)* 5(RI#)* 7(DSR#)* 8(DCD#)* 10(CBUS2)* 13(3V3OUT)* 17(CBUS1)* 18(CBUS0)* 19(CBUS3)*

### Notes on the sheet
- UART Bridge: FT231XS-U
  NOTE: We are not taking in power from VBUS because it is being supplied by the POWER module
  POWER module supplies 5 and 3.3V

### Library data of the parts
C700-C704 = CMP-2000-05017-2: as C504 on sheet 05-StepperMotor; Depth: 1.25mm; Height: 0.85mm; Width: 0.049inch; Tolerance: 10%; Case Code (Metric): 2012; Case Code (Imperial): 0805; Material: Ceramic; Thickness: 0.037inch; Min Operating Temperature: -55°C; Contact Plating: Tin; Length: 2mm; Mount: Surface Mount; Voltage Rating (DC): 50V; Lead Free: Lead Free; Dielectric: X7R; Radiation Hardening: No; Capacitance: 100nF; Voltage Rating: 50V; Case/Package: 0805; Packaging: Tape and Reel; Max Operating Temperature: 125°C; Voltage: 50V
J700 = CMP-1502-03253-1: Micro USB 2.0 Type B Receptacle WR-COM, Horizontal, SMT, with Pads and Pegs; Manufacturer: Wurth Elektronik; Contact Resistance: 30mOhm; Rated Current: 1A; Working Voltage: 30VAC; Datasheet URL: https://katalog.we-online.de/em/datasheet/629105136821.pdf; Mounting Technology: SMT; Publisher: WurthElektronik; Package Reference: 629105136821; Orientation: Horizontal; Packaging: TapeandReel; Part Number: 629105136821; Manufacturer URL: http://www.we-online.de; Connector Type: MicroUSB2.0TypeB; Gender: Receptacle; Operating Temperature: -40to105degC
R700 R701 = CMP-03211-007904-1: CRGCQ0805 27Ω 0.125W ±200ppm/°C 1% 150V; Manufacturer: TE Connectivity; Manufacturer Part Number: CRGCQ0805F27R; Automotive Grade: Grade 323; Tolerance: 0.01; Series: CRGCQ; Automotive: Yes; Temperature Range Low: -55°C; Voltage Rating: 150V; Height: 0.65mm; Power Rating: 0.125W; Temperature Coefficient: ±200ppm/°C; RoHS: TRUE; ComponentLink2Description: Datasheet; Package: CRGCQ0805; Temperature Range High: +155°C; Temperature: -55°C to +155°C; Ipc Land Pattern Name: RESC200125X55; Device Class L2: Resistors; Device Class L3: Chip SMD Resistors; ComponentLink2URL: https://www.te.com/commerce/DocumentDelivery/DDEController?Action=showdoc&DocId=Data+Sheet%7F1773204-3%7F1%7Fpdf%7FEnglish%7FENG_DS_1773204-3_1.pdf%7F4-2176341-332; Value: 27Ω; Mouser Description: Res General Purpose Thick Film 0805 27 Ohm 1% 1/8W ±200ppm/°C Molded Paper T/R; Octopart: https://octopart.com/crgcq0805f27r-te+connectivity-91018166; Lead Free: Yes; Composition: Thick Film; Ambient Temperature Range High: +70°C; Category: Res; Resistance: 27Ω; Device Class L1: Passive Components
R702-R705 = CMP-2001-00580-1: as R502 on sheet 05-StepperMotor
TP700 TP701 = CMP-1672-00008-1: as TP400 on sheet 04-HallEffectSensor; ComponentLink1Description: Manufacturer URL; Package Quantity: 1000; DatasheetVersion: 03/2014; Packaging: Tape and Reel; ComponentLink2URL: http://www.keyelco.com/product-pdf.cfm?p=1357; ComponentLink1URL: http://www.keyelco.com/; Mount: Surface Mount; Contact Plating: Silver; PackageDescription: 1-Pin Surface Mount Device, Body 3.81 x 2.03 mm; Pins: 1; RoHSCompliant: True; Mounting Technology: Surface Mount; ComponentLink2Description: Datasheet; PackageReference: 5019; Supplier 1: Digi-Key; Supplier Part Number 1: 36-5019CT-ND; Manufacturer Part Number 1: 5019; RoHS: Yes; Category: Connectors; Stock 1: 1316816; Pricing 1: 1=0.34000, 25=0.27360, 100=0.22340, 250=0.20064, 500=0.19152 (USD); Number of Pins: 1; Material: Bronze; Contact Material: Bronze; Series: 5019; Termination: SMD/SMT; Height: 0.09inch; RoHS Compliant: Yes; REACH SVHC: No SVHC; Lead Free: Lead Free; ComponentLink3URL: https://datasheet.ciiva.com/16318/m60-2p61-16318395.pdf?src-supplier=Future+Electronics; ComponentLink3Description: https://datasheet.ciiva.com/16318/m60-2p61-16318395.pdf?src-supplier=Future+Electronics; ComponentLink4URL: https://datasheet.ciiva.com/16885/70182998-16885945.pdf?src-supplier=Allied+Electronics; ComponentLink4Description: https://datasheet.ciiva.com/16885/70182998-16885945.pdf?src-supplier=Allied+Electronics; ComponentLink5URL: https://datasheet.ciiva.com/14848/m60-2p61-14848437.pdf?src-supplier=Digi-Key; ComponentLink5Description: https://datasheet.ciiva.com/14848/m60-2p61-14848437.pdf?src-supplier=Digi-Key; ComponentLink6URL: https://datasheet.ciiva.com/14848/m60-2p61-14848438.pdf?src-supplier=Digi-Key; ComponentLink6Description: https://datasheet.ciiva.com/14848/m60-2p61-14848438.pdf?src-supplier=Digi-Key; ComponentLink7URL: https://datasheet.ciiva.com/14848/m60-2p61-14848439.pdf?src-supplier=Digi-Key; ComponentLink7Description: https://datasheet.ciiva.com/14848/m60-2p61-14848439.pdf?src-supplier=Digi-Key
U700 = CMP-0248-00015-2: USB to Full-Handshake UART Interface Chip, UHCI/OHCI/EHCI Compatible, USB 2.0 Compatible, -40 to +85 degC, 20-Pin SSOP, Pb-Free, Tube; Manufacturer: FTDI; PackageDescription: 20-Pin Small Outline Package, 8.6 x 3.9 mm Body, 0.635 mm Pitch; ComponentLink2Description: Datasheet; DatasheetVersion: ver 1.2, Feb-2013; PackageReference: SSOP-20; ComponentLink3URL: www.ftdichip.com/Products/ICs/FT231X.html; ComponentLink2URL: http://www.ftdichip.com/Support/Documents/DataSheets/ICs/DS_FT231X.pdf; PartNumber: FT231XS-U; ComponentLink3Description: FT231X Product Page; ComponentLink1URL: http://www.ftdichip.com/; Code_JEDEC: MO-137-AD; ComponentLink1Description: Manufacturer URL; RevisionNote: DatasheetVersion updated to 1.2 Feb-2013; PackageVersion: Feb-13

## Sheet 08-SwitchingRegulator.SchDoc
size A
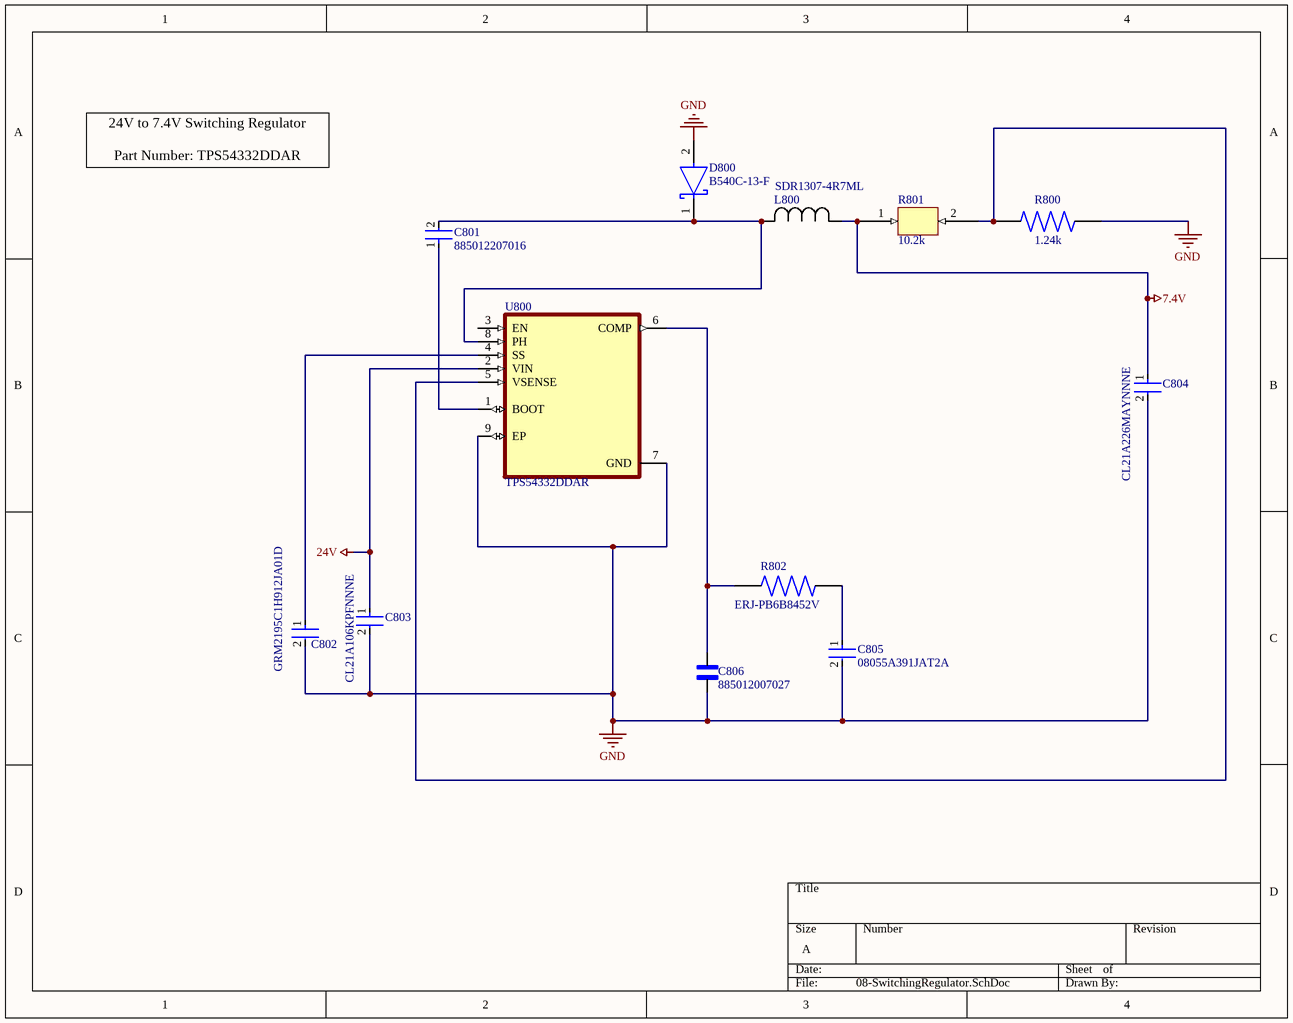
[diagram p7: 08-SwitchingRegulator.SchDoc]

### Parts
C801  885012207016  [FP-885012207016-MFG]
C802  GRM2195C1H912JA01D  [FP-GRM219-0_1-MFG]
C803  CL21A106KPFNNNE  [FP-CL21-IPC_B]
C804  CL21A226MAYNNNE  [FP-CL21-IPC_C]
C805  08055A391JAT2A  [FP-0805-L_2_01_0_2-W_1_25-IPC_C]
C806  885012007027  [WCAP-CSGP_885012007027]
D800  B540C-13-F  [FP-SMC-MFG]
L800  SDR1307-4R7ML  [IND_BOURNS_SDR1307]
R800  value 1.24k  [RES_ERJ1TNF1241U]  (hidden comment: ERJ-1TNF1241U)
R801  10.2k  [PCBComponent_1]
R802  ERJ-PB6B8452V  [RES_ERJ-PB6B1004V]
U800  TPS54332DDAR  [VREG_LM5017MR/NOPB]

### Nets
7.4V: C804.1 L800.1 R801.1
24V: C803.1 U800.2(VIN)
GND: C802.2 C803.2 C804.2 C805.2 C806.1 D800.2(A) R800.1 U800.7(GND) U800.9(EP)
NetC801_1: C801.1 U800.1(BOOT)
NetC801_2: C801.2 D800.1(C) L800.2 U800.8(PH)
NetC802_1: C802.1 U800.4(SS)
NetC805_1: C805.1 R802.1
NetC806_2: C806.2 R802.2 U800.6(COMP)
NetR800_2: R800.2 R801.2 U800.5(VSENSE)

Not connected (* = marked no-connect by the designer): U800 3(EN)

### Notes on the sheet
- 24V to 7.4V Switching Regulator
  Part Number: TPS54332DDAR

### Library data of the parts
C801 = CMP-207839-000050-1: CAP CER 0.1UF 10V X7R 0805; Capacitance: 100nF; Tolerance: 10%; Min Operating Temperature: -55°C; Series: WCAP-CSGP; Voltage Rating: 10V; Max Operating Temperature: 125°C; Case/Package: 0805; Thickness: 0.035inch; Case Code (Imperial): 0805; Width: 0.049inch; Case Code (Metric): 2012; Mount: Surface Mount; Packaging: Cut Tape; RoHS Compliant: Yes; Length: 0.079inch
C802 = CMP-2007-00147-2: Chip Multilayer Ceramic Capacitors for General Purpose, 0805, 9100pF, C0G, 30ppm/°C, 5%, 50V; Capacitance: 9.1nF; Voltage: 50V; Length: 2mm; Termination: SMD/SMT; Radiation Hardening: No; Mount: Surface Mount; Thickness: 0.037inch; Case/Package: 0805; Packaging: Tape and Reel; Case Code (Imperial): 0805; Package Quantity: 1; Voltage Rating (DC): 50V; Depth: 1.25mm; Lead Free: Lead Free; Dielectric: C0G; Voltage Rating: 50V; Tolerance: 5%; Height: 0.85mm; Max Operating Temperature: 125°C; Width: 0.049inch; Case Code (Metric): 2012; Min Operating Temperature: -55°C
C803 = CMP-2000-06103-2: CL21 Series 0805 10uF 10V ±10% Tolerance X5R Multilayer Ceramic Chip Capacitor; Case Code (Imperial): 0805; Capacitance: 10uF; Mount: Surface Mount; Depth: 1.25mm; Length: 2mm; Lead Free: Lead Free; Packaging: Tape and Reel; Dielectric: X5R; Width: 0.049inch; Package Quantity: 1; Height: 1.25mm; Case/Package: 0805; Voltage Rating: 10V; Thickness: 0.053inch; Max Operating Temperature: 85°C; Tolerance: 10%; Case Code (Metric): 2012; Contact Plating: Tin; Min Operating Temperature: -55°C; Radiation Hardening: No; Voltage Rating (DC): 10V
C804 = CMP-13271-003225-1: CL21 Series 0805 22uF 25V ±20% Tolerance X5R Multilayer Ceramic Chip Capacitor
C805 = CMP-2000-05807-2: General Purpose Ceramic Capacitor, 0805, 390pF, 5%, C0G, 30ppm/°C, 50V; Length: 2.01mm; Depth: 1.25mm; Max Operating Temperature: 125°C; Dielectric: C0G; RoHS Compliant: Yes; REACH SVHC: No SVHC; Voltage: 50V; Tolerance: 5%; Mount: Surface Mount; Thickness: 0.037inch; Contact Plating: Tin; Width: 1.25mm; Dielectric Material: Ceramic; Capacitance: 390pF; Min Operating Temperature: -55°C; Case Code (Metric): 2012; Package Quantity: 1; Lead Free: Lead Free; Voltage Rating: 50V; Height: 0.94mm; Number of Pins: 2; Termination: SMD/SMT; Radiation Hardening: No; Temperature Coefficient: 30ppm/°C; Case/Package: 0805; Packaging: Tape and Reel; Voltage Rating (DC): 50V; Case Code (Imperial): 0805
C806 = 885012007027: <b> WCAP-CSGP Ceramic Capacitors <br> <br> <br><b>Characteristics </b><br> </b><br>Multilayer Ceramic Chip Capacitor <br>Recommended soldering:Reflow, for 0603 and 0805 wave soldering is also allowed <br>Operating temperature:-55 Â°C to +125 Â°C; <br>Ceramic characteristics: Class I - NPO ; Class II -X7R, X5R <br>High performance ceramic <br>High capacitance stability <br>Minimal aging  <br>Termination:Cu/Ni/Sn <br>   <br><a href="http://katalog.we-online.de/media/images/eisos/WCAP-CSGP_pf2.jpg" title="Enlarge picture"> <img src="http://katalog.we-online.de/media/thumbs2/eisos/thb_WCAP-CSGP_pf2.jpg" width="320"></a><p> Details see: <a href="http://katalog.we-online.de/en/pbs/WCAP-CSGP-0805?">http://katalog.we-online.de/en/pbs/WCAP-CSGP-0805? </a><p>Created:  2015-01-28 <br>2015 (C) Wurth Elektronik; Package: None; Price: None; Value: *; MP: 885012007027; Availability: Unavailable; Supplier 1: Digi-Key; Supplier Part Number 1: 732-7826-1-ND
D800 = CMP-2000-05097-3: DIODE SCHOTTKY 40V 5A SMC; Manufacturer: Diodes Inc.; Automotive Grade: NA; Peak Reverse Current: 0.5mA; Value: 300pF; Max Junction Temp: +150°C; Max Surge Forward Current: 100A; Standoff Height: 0.1mm; Digikey Description: DIODE SCHOTTKY 40V 5A SMC; Temperature Range Low: -55°C; Manufacturer Part Number: B540C-13-F; Octopart: https://octopart.com/b540c-13-f-diodes+inc.-325873; Lead Free: Yes; Reverse Voltage: 40V; RoHS: TRUE; Category: Diode; Mouser Description: Diode: Schottky rectifying; SMD; 40V; 5A; SMC; Package: reel, tape; ComponentLink2Description: Datasheet; Temperature Range High: +150°C; Automotive: No; Footprint Url: https://www.diodes.com/assets/Package-Files/SMC.pdf; Device Class L3: Schottky Diodes; Height: 2.5mm; Forward Current: 5A; Temperature: -55°C to +150°C; Package: SMC; ComponentLink2URL: https://www.diodes.com/assets/Datasheets/ds13012.pdf; Device Class L2: Diodes; Max Repetitive Reverse Voltage: 40V; Device Class L1: Discrete Semiconductors; Capacitance: 300pF
L800 = SDR1307-4R7ML: No Description Available; Mfr_Name: Bourns Electronics; Copyright: Copyright (C) 2023 Ultra Librarian. All rights reserved.; Manufacturer_Part_Number: SDR1307-4R7ML; Digi-Key_Part_Number_1: SDR1307-4R7MLCT-ND; Digi-Key_Part_Number_2: SDR1307-4R7MLDKR-ND; Digi-Key_Part_Number_3: SDR1307-4R7MLTR-ND; Supplier 1: Digi-Key; Supplier Part Number 1: SDR1307-4R7MLCT-ND
R800 = ERJ1TNF1241U: MP: ERJ1TNF1241U; Availability: Unavailable; Package: None; Price: None
R801 = Component_2
R802 = ERJ-PB6B8452V: MF: {'manufacturer': u'Panasonic'}; MP: ERJ-PB6B8452V; Availability: Unavailable; Package: None; Value: *; Price: None; Supplier 1: Digi-Key; Supplier Part Number 1: P20814CT-ND
U800 = TPS54332DDAR: 3.5V to 28V Input, 3.5A, 1MHz Step-Down Converter with Eco-mode; MF: Texas Instruments; Check_prices: https://www.snapeda.com/parts/TPS54332DDAR/Texas+Instruments/view-part/?ref=eda; Value: *; MP: TPS54332DDAR; Purchase-URL: https://pricing.snapeda.com/search/part/TPS54332DDAR/?ref=eda; SnapEDA_Link: https://www.snapeda.com/parts/TPS54332DDAR/Texas+Instruments/view-part/?ref=snap; Package: HSOIC-8 Texas Instruments; Digi-Key_Part_Number: 296-39420-2-ND

## Nets that join several sheets
3.3V: 03-Power (7 pins), 02-MCU (10 pins), 04-HallEffectSensor (R403.2 U400.8 U403.5), 05-StepperMotor (C509.1 C510.1 C511.1 SW500.6), 07-UARTBridge (C702.1 U700.3 U700.14)
5V: 03-Power (7 pins), 04-HallEffectSensor (C400.1 C401.1 C402.1 SW400.6), 05-StepperMotor (R514.2), 07-UARTBridge (C703.1 C704.1 TP700.1 U700.15)
7.4V: 03-Power (C302.1 TP300.1), 06-ServoMotor (C600.1 C601.1 C602.1 SW600.6), 08-SwitchingRegulator (C804.1 L800.1 R801.1)
24V: 03-Power (5 pins), 05-StepperMotor (7 pins), 08-SwitchingRegulator (C803.1 U800.2)
GND: 03-Power (17 pins), 02-MCU (15 pins), 04-HallEffectSensor (10 pins), 05-StepperMotor (21 pins), 06-ServoMotor (5 pins), 07-UARTBridge (10 pins), 08-SwitchingRegulator (9 pins)
3V3_PWR_GOOD: 03-Power (D303.2 R306.1 U304.1), 02-MCU (U200.1)
P0_0: 02-MCU (C202.2 MD200.5 Y200.1), 05-StepperMotor (R502.1)
P0_1: 02-MCU (C203.2 MD200.6 Y200.2), 05-StepperMotor (R503.1)
P0_4: 02-MCU (MD200.41), 05-StepperMotor (R504.1)
P0_5: 02-MCU (MD200.2), 05-StepperMotor (R506.1)
P5_0: 02-MCU (MD200.39), 05-StepperMotor (R507.1)
P5_1: 02-MCU (MD200.40), 05-StepperMotor (R508.1)
P5_2: 02-MCU (MD200.38), 05-StepperMotor (R509.1)
P5_3: 02-MCU (MD200.37), 05-StepperMotor (R512.1)
P5_4: 02-MCU (MD200.25), 05-StepperMotor (R513.1)
P6_2: 02-MCU (MD200.28), 06-ServoMotor (R601.1)
P10.0: 02-MCU (MD200.13), 07-UARTBridge (R702.1)
P10.1: 02-MCU (MD200.12), 07-UARTBridge (R703.1)
P10.2: 02-MCU (MD200.33), 07-UARTBridge (R704.1)
P10.3: 02-MCU (MD200.7), 07-UARTBridge (R705.1)
P10.6: 02-MCU (MD200.10), 04-HallEffectSensor (C405.1 R405.1 U400.1)